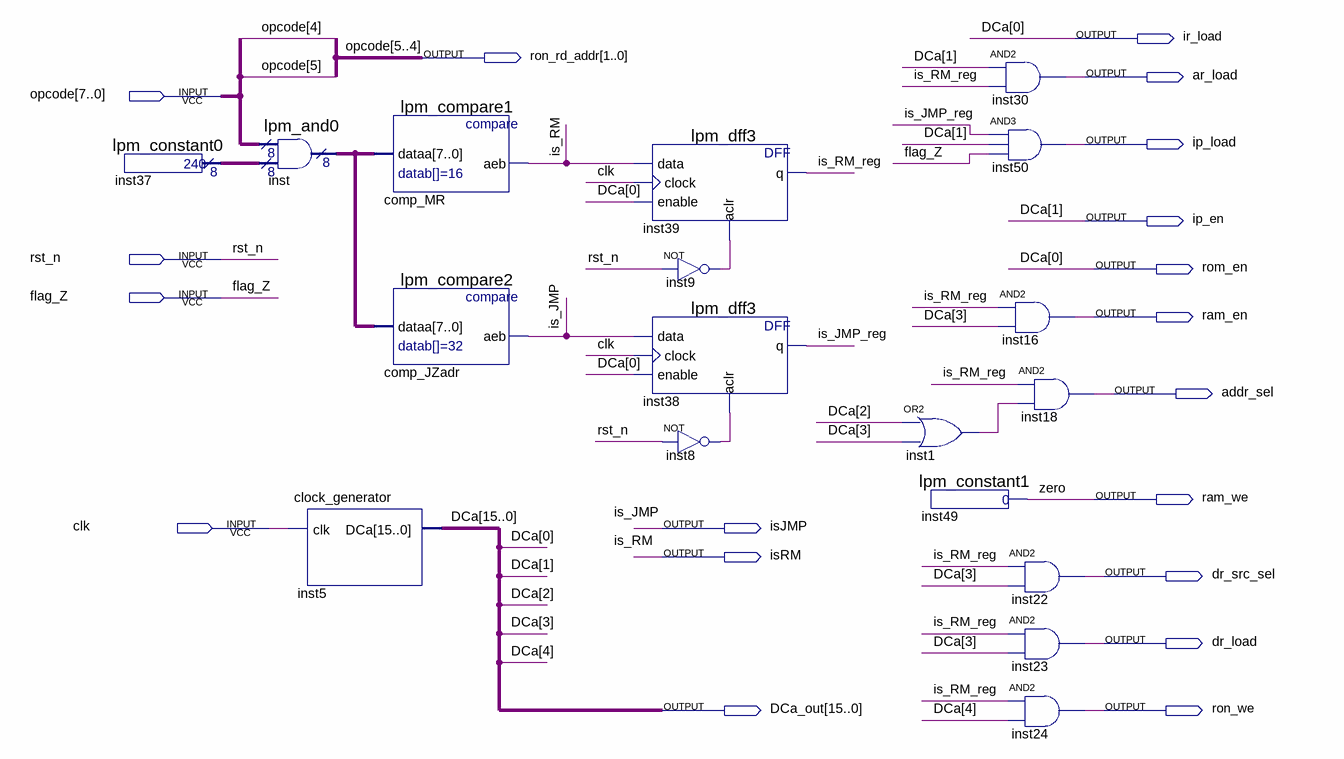
[diagram p0: schematic sheet]
// Quartus schematic control_unit.bdf as structural Verilog: 18 symbols, 19 pins
module control_unit (
  input  [7:0] opcode,
  input  rst_n,
  input  flag_Z,
  input  clk,
  output ir_load,
  output [1:0] ron_rd_addr,
  output ar_load,
  output ip_load,
  output ip_en,
  output rom_en,
  output ram_en,
  output addr_sel,
  output ram_we,
  output isJMP,
  output isRM,
  output dr_src_sel,
  output dr_load,
  output [15:0] DCa_out,
  output ron_we
);

  wire inst1_out, inst8_out, inst9_out, is_JMP_reg, is_RM_reg;
  wire [7:0] inst37_result, inst_result;

  lpm_constant0 inst37 (.result(inst37_result));
  lpm_and0 inst (.data0x(opcode), .data1x(inst37_result), .result(inst_result));
  clock_generator inst5 (.clk(clk), .DCa(DCa_out));
  lpm_compare1 comp_MR (.dataa(inst_result), .aeb(isRM));
  lpm_compare2 comp_JZadr (.dataa(inst_result), .aeb(isJMP));
  lpm_dff3 inst39 (.data(isRM), .clock(clk), .enable(DCa_out[0]), .aclr(inst9_out), .q(is_RM_reg));
  not inst9 (inst9_out, rst_n);
  lpm_dff3 inst38 (.data(isJMP), .clock(clk), .enable(DCa_out[0]), .aclr(inst8_out), .q(is_JMP_reg));
  not inst8 (inst8_out, rst_n);
  or inst1 (inst1_out, DCa_out[2], DCa_out[3]);
  lpm_constant1 inst49 (.result(ram_we));
  and inst30 (ar_load, DCa_out[1], is_RM_reg);
  and inst50 (ip_load, is_JMP_reg, DCa_out[1], flag_Z);
  and inst16 (ram_en, is_RM_reg, DCa_out[3]);
  and inst18 (addr_sel, is_RM_reg, inst1_out);
  and inst22 (dr_src_sel, is_RM_reg, DCa_out[3]);
  and inst23 (dr_load, is_RM_reg, DCa_out[3]);
  and inst24 (ron_we, is_RM_reg, DCa_out[4]);

  assign ip_en = DCa_out[1];
  assign ir_load = DCa_out[0];
  assign rom_en = DCa_out[0];
  assign ron_rd_addr = opcode[5:4];

  // Other names for the same wires on the sheet: DCa[15:0] = DCa_out; is_JMP = isJMP; is_RM = isRM; zero = ram_we
endmodule
